# EasyEDA schematic 1-Schematic_ProjetoSemestral.json
TITLE: Sheet_1; REV: 1.0; Date: 2021-03-08; Sheet: 1/1; Drawn By: coc; Company: Your Company
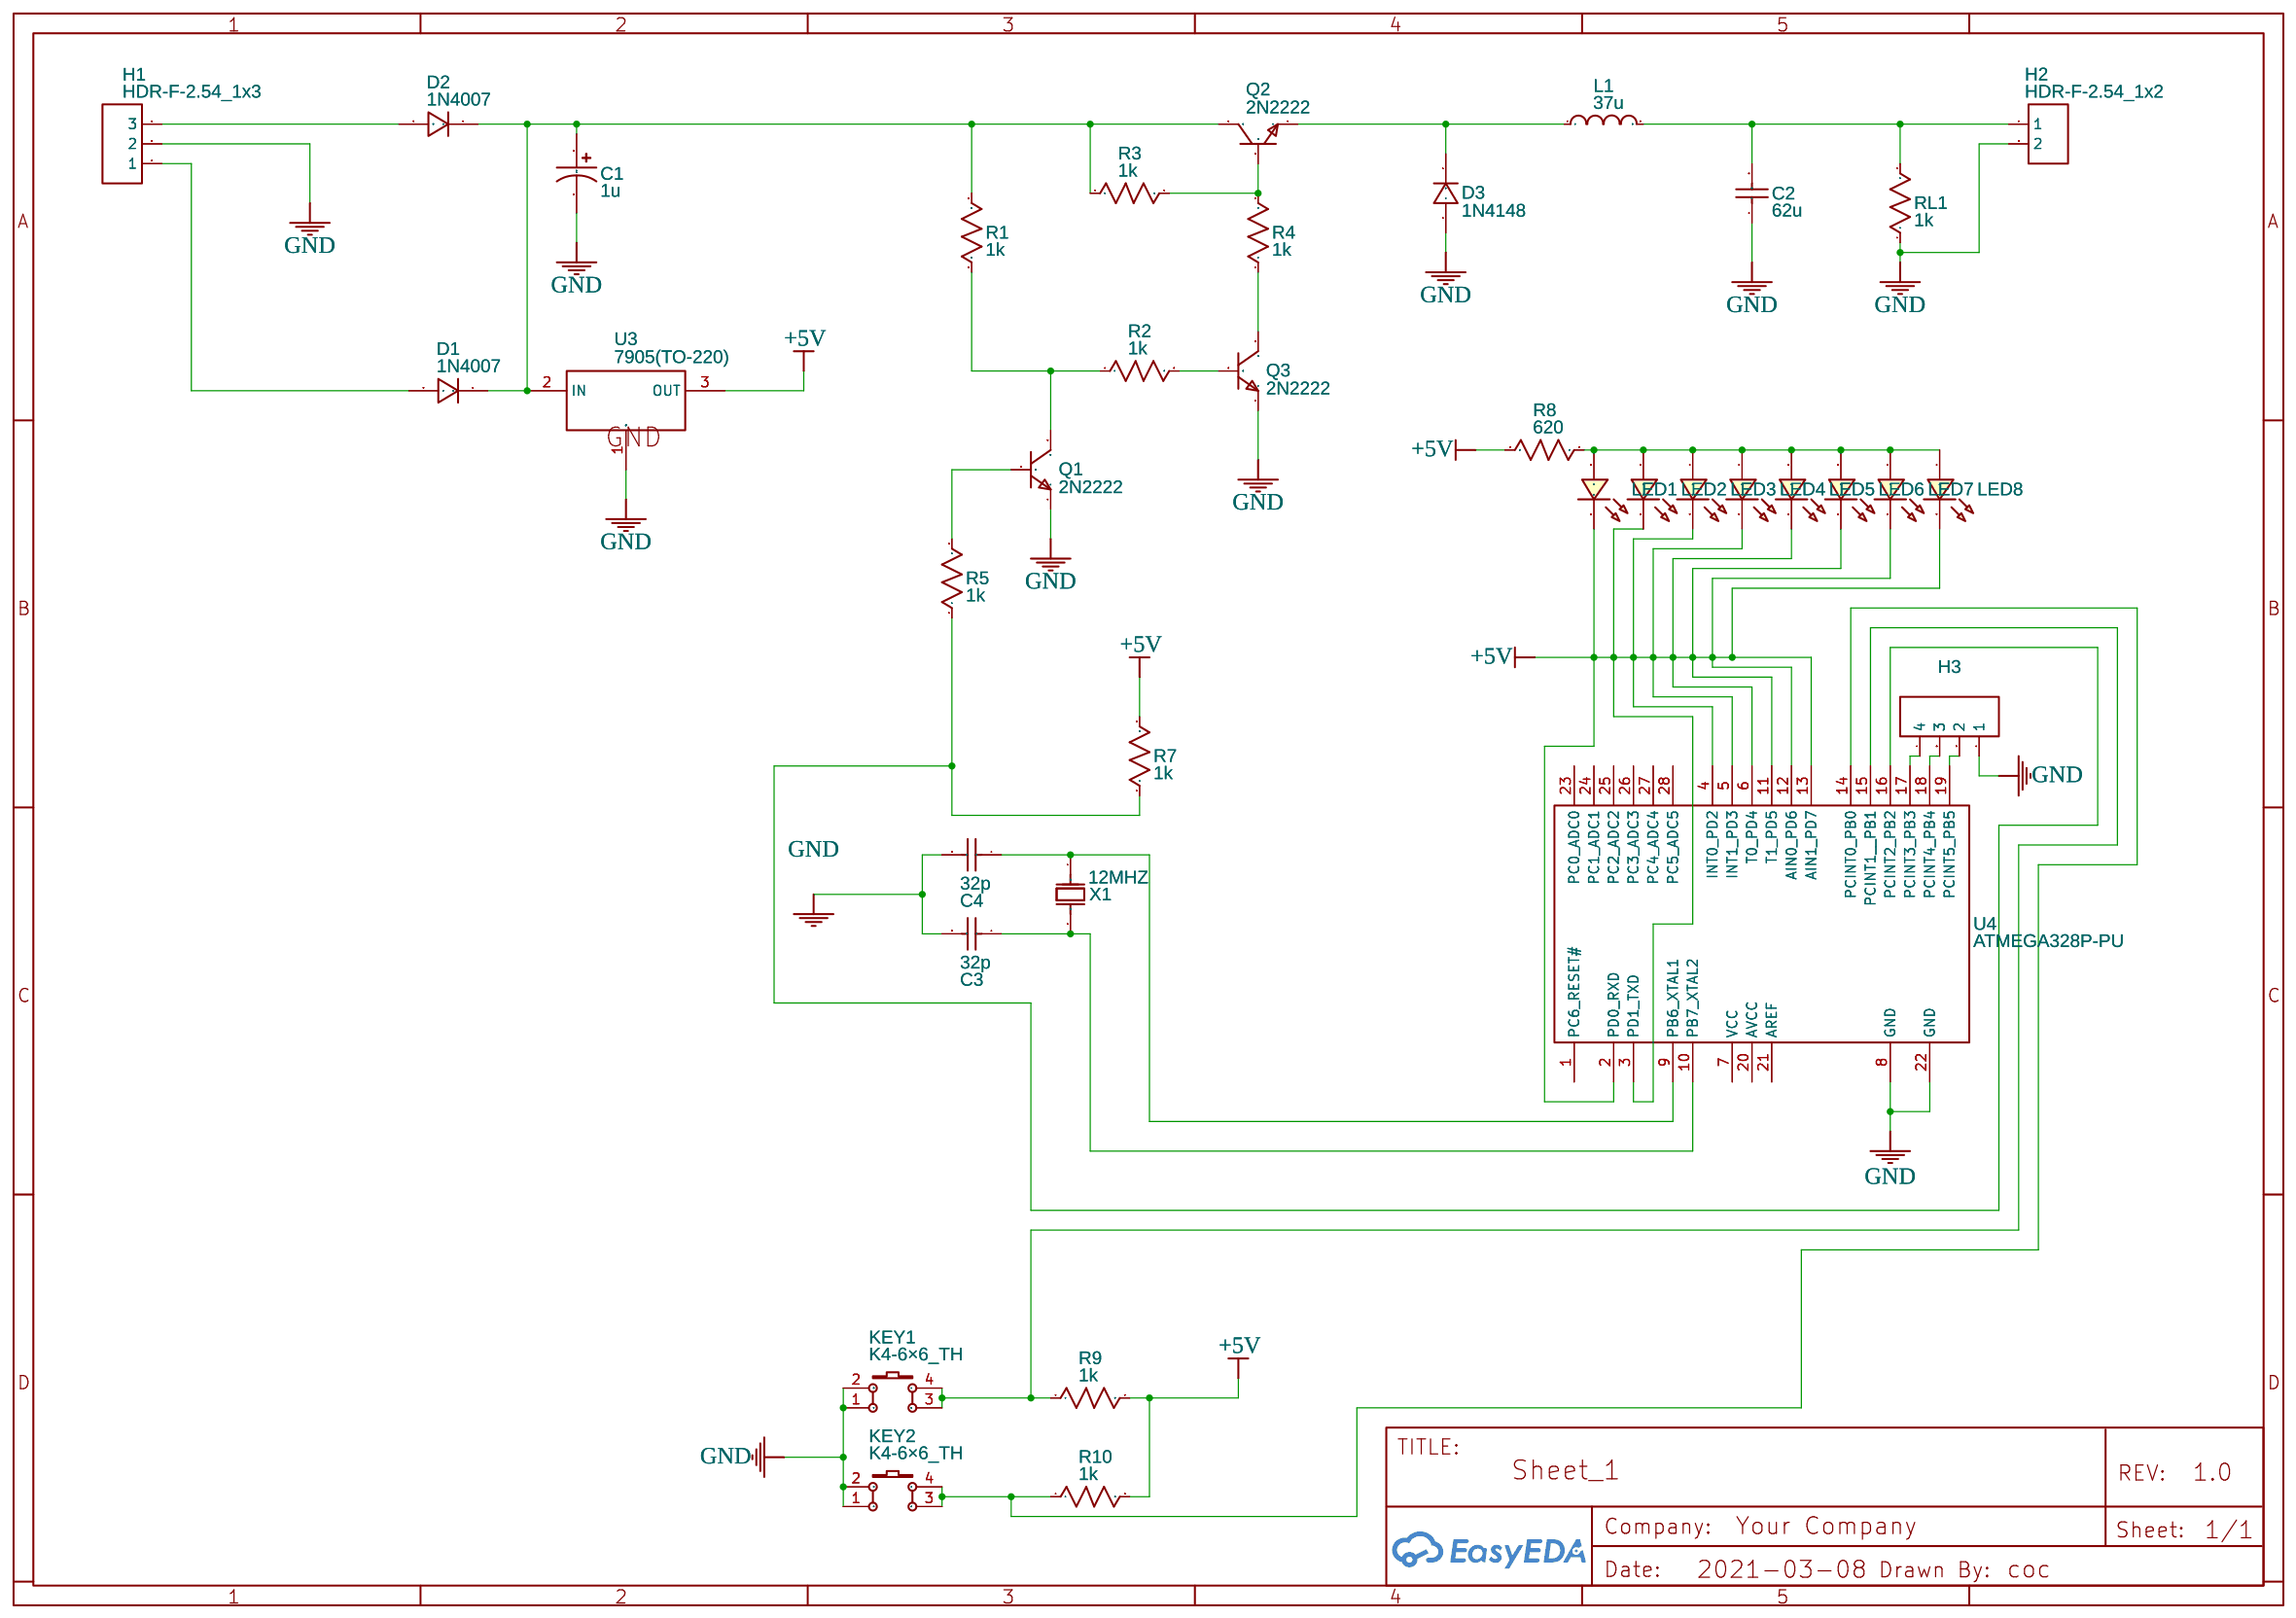
[diagram p0: schematic sheet]

## Parts
C1  1u  [CAP-D3.0×F1.5]
C2  62u  [CAP-TH_L6.5-W4.0-P5.00-D1.0]
C3  32p  [CAP-TH_L6.5-W4.0-P5.00-D1.0]
C4  32p  [CAP-TH_L6.5-W4.0-P5.00-D1.0]
D1  1N4007  [DO-41_BD2.4-L4.7-P8.70-D0.9-RD]
D2  1N4007  [DO-41_BD2.4-L4.7-P8.70-D0.9-RD]
D3  1N4148  [DO-35_BD2.0-L4.0-P8.00-D0.5-FD]
H1  HDR-F-2.54_1x3  [HDR-F-2.54_1X3]
H2  HDR-F-2.54_1x2  [HDR-F-2.54_1X2]
H3  HDR-F-2.54_1x4  [HDR-F-2.54_1X4]
KEY1  K4-6×6_TH  [KEY-TH_4P-L6.0-W6.0-P4.50-LS6.5]
KEY2  K4-6×6_TH  [KEY-TH_4P-L6.0-W6.0-P4.50-LS6.5]
L1  37u  [L_AXIAL-0.4]
LED1  LED-TH-3mm_R  [LED-TH_BD3.0_RED]
LED2  LED-TH-3mm_R  [LED-TH_BD3.0_RED]
LED3  LED-TH-3mm_R  [LED-TH_BD3.0_RED]
LED4  LED-TH-3mm_R  [LED-TH_BD3.0_RED]
LED5  LED-TH-3mm_R  [LED-TH_BD3.0_RED]
LED6  LED-TH-3mm_R  [LED-TH_BD3.0_RED]
LED7  LED-TH-3mm_R  [LED-TH_BD3.0_RED]
LED8  LED-TH-3mm_R  [LED-TH_BD3.0_RED]
Q1  2N2222  [TO-92-3_L4.9-W3.7-P1.27-L]
Q2  2N2222  [TO-92-3_L4.9-W3.7-P1.27-L]
Q3  2N2222  [TO-92-3_L4.9-W3.7-P1.27-L]
R1  1k  [R_AXIAL-0.3]
R2  1k  [R_AXIAL-0.3]
R3  1k  [R_AXIAL-0.3]
R4  1k  [R_AXIAL-0.3]
R5  1k  [R_AXIAL-0.3]
R7  1k  [R_AXIAL-0.3]
R8  620  [R_AXIAL-0.3]
R9  1k  [R_AXIAL-0.3]
R10  1k  [R_AXIAL-0.3]
RL1  1k  [R_AXIAL-0.3]
U3  7905(TO-220)  [TO-220-3_L10.0-W4.5-P2.54-L]
U4  ATMEGA328P-PU  [DIP-28_L34.6-W7.3-P2.54-LS10.2-BL]
X1  12MHZ  [HC-49S_L11.0-W4.6-P4.88]

## Library data of the parts
C1 = CE_TH_D3.0×F1.5_US: Contributor: LCEDA_Lib
C2-C4 = CAPACITOR15NF100V: Supplier: LCSC; Manufacturer: ReliaPro; Manufacturer Part: Capacitor15nf100v; Contributor: LCSC; Supplier Part: C26191; Package Display: No
D1 D2 = 1N4007: Supplier: LCSC; Manufacturer: SEMTECH; Supplier Part: C106903; Contributor: LCEDA_Lib
D3 = 1N4148: Supplier: LCSC; Manufacturer: SEMTECH; Supplier Part: C14516; Contributor: LCEDA_Lib
H1 = HDR-F-2.54_1x3: Supplier Part: C146690; Supplier: LCSC; Contributor: LCEDA_Lib
H2 = HDR-F-2.54_1x2: Supplier Part: C49661; Supplier: LCSC; Contributor: LCEDA_Lib
H3 = HDR-F-2.54_1x4: Supplier Part: C225501; Supplier: LCSC; Contributor: LCEDA_Lib
KEY1 KEY2 = K4-6×6_TH: Supplier: LCSC; Supplier Part: C136684; Manufacturer: 韩国韩荣; Manufacturer Part: K2-1102DP-E4SW-04; Contributor: LCEDA_Lib
L1 = L_AXIAL-0.4_US: Contributor: LCEDA_Lib
LED1-LED8 = LED-TH-3mm_R: Manufacturer: EVERLIGHT(台湾亿光); Manufacturer Part: 204-10SDRD/S530-A3-L; Supplier Part: C84774; Supplier: LCSC; Contributor: LCEDA_Lib
Q1-Q3 = 2N2222: Supplier: LCSC; Manufacturer: SEMTECH; Contributor: LCSC; Supplier Part: C118536; LCSC Assembly: Yes; SMT Type: Extend
R1-R5 R7-R10 RL1 = R_AXIAL-0.3_US: Contributor: LCEDA_Lib
U3 = 7905(TO-220): Supplier: LCSC; Manufacturer: STMicroelectronics; Manufacturer Part: L7905CV-DG; image: //image.lceda.cn/szlcsc/C3799.jpg; Supplier Part: C3799; Contributor: LCEDA_Lib
U4 = ATMEGA328P-PU: sourceId: Oic6oiASL; Supplier: LCSC; Manufacturer: MICROCHIP; image: //image.lceda.cn/szlcsc/C33901.jpg; Contributor: LCSC; Supplier Part: C33901
X1 = 49SAC12000202060: Supplier: LCSC; Supplier Part: C390746; Manufacturer: JGHC; Contributor: LCSC; LCSC Assembly: Yes; SMT Type: Extend

## Nets
+5V: LED1.2 LED2.2 LED3.2 LED4.2 LED5.2 LED6.2 LED7.2 LED8.2 R7.2 R8.2 R9.2 R10.2 U3.3(OUT) U4.2(PD0 RXD) U4.3(PD1 TXD) U4.4(INT0 PD2) U4.5(INT1 PD3) U4.6(T0 PD4) U4.11(T1 PD5) U4.12(AIN0 PD6) U4.13(AIN1 PD7)
GND: C1.2 C2.1 C3.2 C4.2 D3.1 H1.2 H2.2 H3.1 KEY1.1 KEY1.2 KEY2.1 KEY2.2 Q1.1(E) Q3.1(E) RL1.1 U3.1(GND) U4.8(GND) U4.22(GND)
Net-(C1-1): C1.1 D1.1 D2.1 Q2.3(C) R1.2 R3.1 U3.2(IN)
Net-(C2-2): C2.2 H2.1 L1.2 RL1.2
Net-(C3-1): C3.1 U4.10(PB7 XTAL2) X1.2(OSC2)
Net-(C4-1): C4.1 U4.9(PB6 XTAL1) X1.1(OSC1)
Net-(D1-2): D1.2 H1.1
Net-(D2-2): D2.2 H1.3
Net-(D3-2): D3.2 L1.1 Q2.1(E)
Net-(H3-2): H3.2 U4.19(PCINT5 PB5)
Net-(H3-3): H3.3 U4.18(PCINT4 PB4)
Net-(H3-4): H3.4 U4.17(PCINT3 PB3)
Net-(KEY1-3): KEY1.3 KEY1.4 R9.1 U4.15(PCINT1  PB1)
Net-(KEY2-3): KEY2.3 KEY2.4 R10.1 U4.14(PCINT0 PB0)
Net-(LED1-1): LED1.1 LED2.1 LED3.1 LED4.1 LED5.1 LED6.1 LED7.1 LED8.1 R8.1
Net-(Q1-2): Q1.2(B) R5.2
Net-(Q1-3): Q1.3(C) R1.1 R2.1
Net-(Q2-2): Q2.2(B) R3.2 R4.2
Net-(Q3-2): Q3.2(B) R2.2
Net-(Q3-3): Q3.3(C) R4.1
Net-(R5-1): R5.1 R7.1 U4.16(PCINT2 PB2)

Not connected (* = marked no-connect by the designer): U4 1(PC6 RESET#) 7(VCC) 20(AVCC) 21(AREF) 23(PC0 ADC0) 24(PC1 ADC1) 25(PC2 ADC2) 26(PC3 ADC3) 27(PC4 ADC4) 28(PC5 ADC5)
